# Altium schematic sheet [5]High_V_Sensor.SchDoc
size B; SheetNumber: 0; SheetTotal: 0
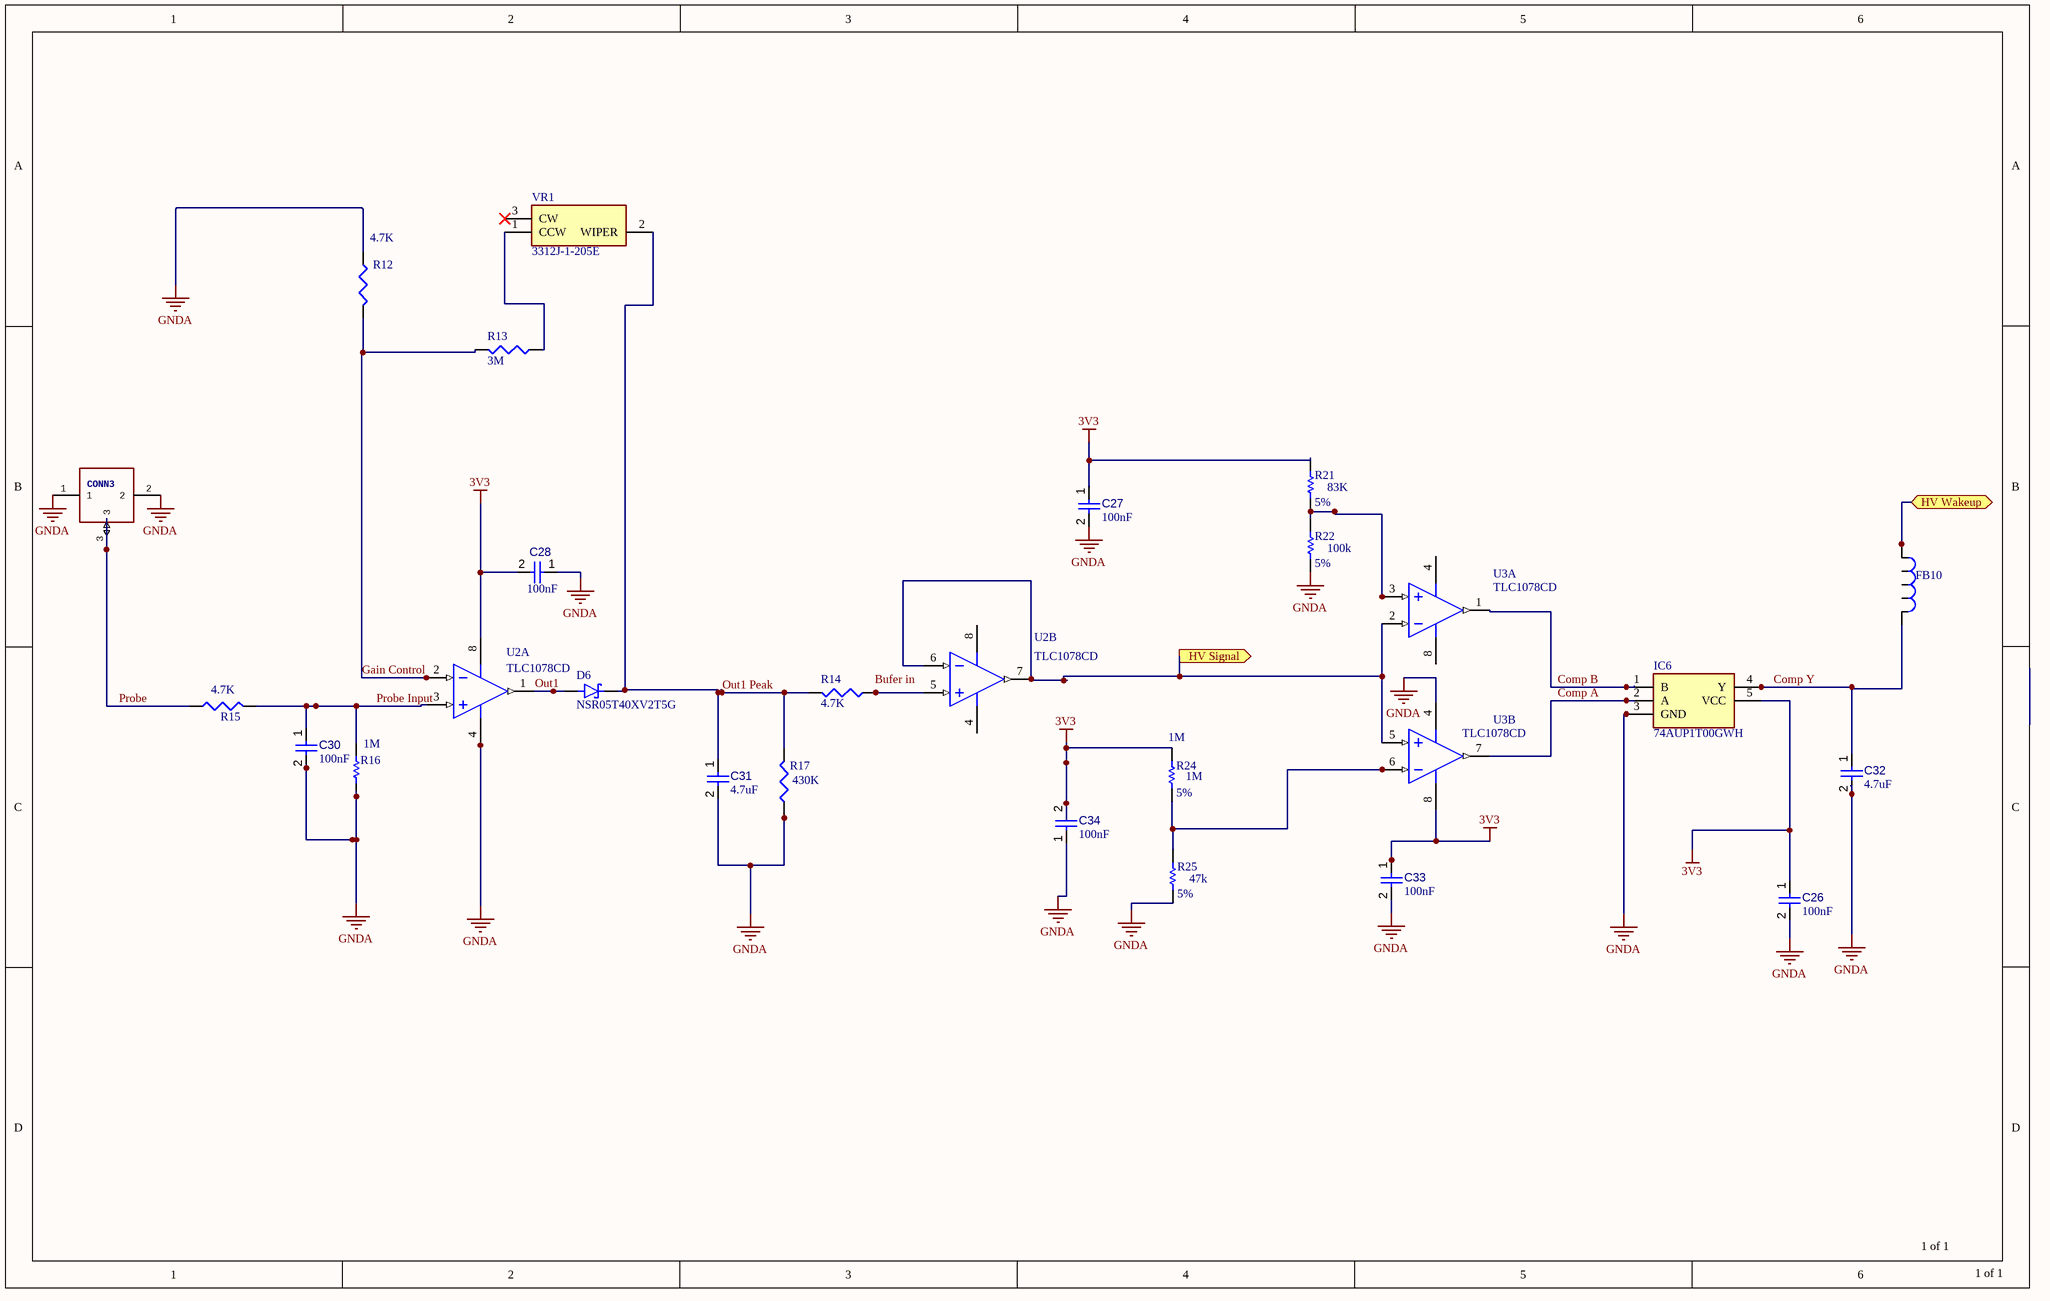
[diagram p0: [5]High_V_Sensor.SchDoc]

## Parts
C26  value 100nF  [CAPC1608X90X40ML10T20]  (hidden comment: Capacitor 100 nF +/-10% 50 V 0603)
C27  value 100nF  [CAPC1608X90X40ML10T20]  (hidden comment: Capacitor 100 nF +/-10% 50 V 0603)
C28  value 100nF  [CAPC1608X90X40ML10T20]  (hidden comment: Capacitor 100 nF +/-10% 50 V 0603)
C30  value 100nF  [CAPC1608X90X40ML10T20]  (hidden comment: Capacitor 100 nF +/-10% 50 V 0603)
C31  4.7uF  [CAPC1608X90X40ML10T20]
C32  4.7uF  [CAPC1608X90X40ML10T20]
C33  value 100nF  [CAPC1608X90X40ML10T20]  (hidden comment: Capacitor 100 nF +/-10% 50 V 0603)
C34  value 100nF  [CAPC1608X90X40ML10T20]  (hidden comment: Capacitor 100 nF +/-10% 50 V 0603)
CONN3  U.FL-R-SMT-1  [U.FL-R-SMT-1]  (value not drawn)
D6  NSR05T40XV2T5G  [DIOM1006X40N]
FB10  BLM18AG102SN1D  [Ferrite Bead]  (value not drawn)
IC6  74AUP1T00GWH  [SOT65P212X110-5N]
R12  4.7K  [RESC0603]
R13  3M  [RESC0603]
R14  4.7K  [RESC0603]
R15  4.7K  [RESC0603]
R16  1M  [RES 0603]
R17  430K  [RESC0603]
R21  value 83K  Tolerance: 5%  [RES 0603]  (hidden comment: 83.3K)
R22  value 100k  Tolerance: 5%  [RES 0603]  (hidden comment: RES 100K 5% 0.1W [0603])
R24  1M  Tolerance: 5%  [RES 0603]
R25  value 47k  Tolerance: 5%  [RES 0603]  (hidden comment: RES 47K 5% 0.1W [0603])
U2  TLC1078CD  [D0008A_N]  (parts A,B of 2)
U3  TLC1078CD  [D0008A_N]  (parts A,B of 2)
VR1  3312J-1-205E  [3312J1502E]

## Ports
HV Signal (out), HV Wakeup (bidir)

## Nets
3V3: C26.1 C27.1 C28.2 C33.1 C34.2 IC6.5(VCC) R21.2 R24.2 U2.8(VDD) U3.8(VDD)
GNDA: C26.2 C27.2 C28.1 C30.2 C31.2 C32.2 C33.2 C34.1 CONN3.1 CONN3.2 IC6.3(GND) R12.1 R16.1 R17.1 R22.1 R25.1 U2.4(GND) U3.4(GND)
Comp A: IC6.2(A) U3.7(OUT2)
Comp B: IC6.1(B) U3.1(OUT1)
Comp Y: C32.1 FB10.2 IC6.4(Y)
Gain Control: R12.2 R13.2 U2.2(IN1-)
HV Signal: U2.6(IN2-) U2.7(OUT2) U3.2(IN1-) U3.5(IN2+) ; port HV Signal
HV Wakeup: FB10.1 ; port HV Wakeup
Out1: D6.A U2.1(OUT1)
Out1 Peak: C31.1 D6.C(K) R14.2 R17.2 VR1.2(WIPER)
Probe: CONN3.3 R15.1
Probe Input: C30.1 R15.2 R16.2 U2.3(IN1+)
NetR13_1: R13.1 VR1.1(CCW)
NetR14_1: R14.1 U2.5(IN2+)
NetR21_1: R21.1 R22.2 U3.3(IN1+)
NetR24_1: R24.1 R25.2 U3.6(IN2-)

Not connected (* = marked no-connect by the designer): VR1 3(CW)*

## Notes on the sheet
- 1 of 1
- Labels drawn without touching a wire or pin: Bufer in

## Library data of the parts
C26-C28 C30 C33 C34 = CMP-001-00017-4: Chip Capacitor, 100 nF, +/- 10%, 50 V, 0603 (1608 Metric); Capacitor Type: Ceramic; Voltage Rating: 50V; RoHS Compliant: True; Max Operating Temperature: 125°C; Pins: 2; Mounting Technology: SM; Min Operating Temperature: -55°C; Tolerance: 10%; Case/Package: 0603
C31 C32 = CMP-001-00017-4: Chip Capacitor, 4.7uF, +/- 10%, 50 V, 0603 (1608 Metric); Capacitor Type: Ceramic; Voltage Rating: 50V; RoHS Compliant: True; Value: 4.7uF; Max Operating Temperature: 125°C; Pins: 2; Mounting Technology: SM; Min Operating Temperature: -55°C; Tolerance: 10%; Case/Package: 0603
CONN3 = U.FL-R-SMT-1: GateName_1: G$1; SymbolName_1: U.FL-R-SMT-1; LibraryName: Kris; DeviceSetName: U.FL-R-SMT-1
D6 = NSR0530P2T5G: Diode Schottky 30V 500mA (DC) Surface Mount SOD-923; MF: ON Semiconductor; SnapEDA_Link: https://www.snapeda.com/parts/NSR0530P2T5G/ON%20Semiconductor/view-part/435832/?ref=snap; Arrow_Asia-Purchase-URL: https://snapeda.com/shop?store=Arrow+Asia&id=435832; Mouser-Purchase-URL: https://snapeda.com/shop?store=Mouser&id=435832; Availability: Good; DigiKey-Purchase-URL: https://snapeda.com/shop?store=DigiKey&id=435832; MP: NSR0530P2T5G; Package: SOD-923-2 ON Semiconductor; Value: *; Price: None; Arrow_Electronics-Purchase-URL: https://snapeda.com/shop?store=Arrow+Electronics&id=435832; Check_prices: https://www.snapeda.com/parts/NSR0530P2T5G/ON%20Semiconductor/view-part/435832/?ref=eda
FB10 = Ferrite Bead: Ferrite Bead 1KOhm @100MHz; Datasheet: https://www.murata.com/en-us/products/productdata/8796738650142/ENFA0003.pdf?src-supplier=Digi-Key; Supplier 1: Mouser; Supplier Part Number 1: 81-BLM11A102S; PN: BLM18AG102SN1D
IC6 = 74AUP1T87GWH: Integrated Circuit; Manufacturer_Name: Nexperia; Datasheet Link: https://assets.nexperia.com/documents/data-sheet/74AUP1T87.pdf; Height: 1.1mm; Manufacturer_Part_Number: 74AUP1T00GWH; Mouser Part Number: 771-74AUP1T87GWH; Mouser Price/Stock: https://www.mouser.com/Search/Refine.aspx?Keyword=771-74AUP1T87GWH; Arrow Part Number: 74AUP1T87GWH; Arrow Price/Stock: https://www.arrow.com/en/products/74aup1t87gwh/nexperia
R12-R15 R17 = RESISTOR
R16 R24 = RES 3.3M 1% 0.1W [0603]: 1M 1% 0.1W [0603]; Supplier 1: Digi-Key; Supplier Part Number 1: 541-3.30MHCT-ND; Value: 1M
  R16: Tolerance: 1%
R21 = RES 3.3M 1% 0.1W [0603]: RES 83.3K 1% 0.1W [0603]; Supplier 1: Digi-Key; Supplier Part Number 1: 541-3.30MHCT-ND
R22 R25 = RES 3.3M 1% 0.1W [0603]: Supplier 1: Digi-Key; Supplier Part Number 1: 541-3.30MHCT-ND
U2 U3 = TLC1078: Dual Micropower Precision Low-Voltage Operational Amplifier, 1.4 to 16 V, 0 to 70 degC, 8-pin SOIC (D8), Green (RoHS & no Sb/Br); Manufacturer: Texas Instruments; CMRR(Min)(dB): 70; Rating: Catalog; Vio (25C)(Max)(mV): 0.45; Slew Rate(Typ)(V/us): 32; Total Supply Voltage(Min)(+5V is 5, +/-5V is 10): 1.4; Total Supply Voltage(Max)(+5V is 5, +/-5V is 10): 16; Sub Family: Low Offset Voltage Amplifier (<=500uV), Low Power Amp (<=500uA), Low Supply Voltage Amplifier (<=2.7V), Precision Amplifier; Packing: TUBE; Number of Channels: 2; GBW(Typ)(MHz): 0.085; IIB(Max)(pA): 60; Iq per channel(Max)(mA): 0.017; Offset Drift(Typ)(uV/C): 1.1; ComponentLink1Description: Manufacturer URL; ComponentLink3URL: http://www.ti.com/litv/pdf/msoi002j; PackageDescription: 8-Pin Plastic Small Outline, Body 4.9 x 3.9 mm, Pitch 1.27 mm; ComponentLink2Description: Datasheet; ComponentLink2URL: http://www.ti.com/lit/ds/symlink/tlc1078.pdf; PackageVersion: 4040047-3/M, 06/2011; Mounting Technology: Surface Mount; PartNumber: TLC1078CD; DatasheetVersion: SLOS179A; Eco-Plan: Green (RoHS & no Sb/Br); ComponentLink3Description: Package Specification; PackageReference: D0008A; ComponentLink1URL: http://www.ti.com/; Code_JEDEC: MS-012
VR1 = 3312J-1-502E: Variable Resistor, 2M Ohm; Manufacturer_Name: Bourns; Datasheet Link: https://componentsearchengine.com/Datasheets/2/3312J-1-502E.pdf; Height: 2mm; Manufacturer_Part_Number: 3312J-1-205; Mouser Part Number: 652-3312J-1-205E; Mouser Price/Stock: https://www.mouser.co.uk/ProductDetail/Bourns/3312J-1-502E?qs=4GfDZFxiN8vu5YclxULe3Q%3D%3D; Arrow Part Number: 3312J-1-502E; Arrow Price/Stock: https://www.arrow.com/en/products/3312j-1-502e/bourns